# EAGLE design OpenSSM (EAGLE 5.09)
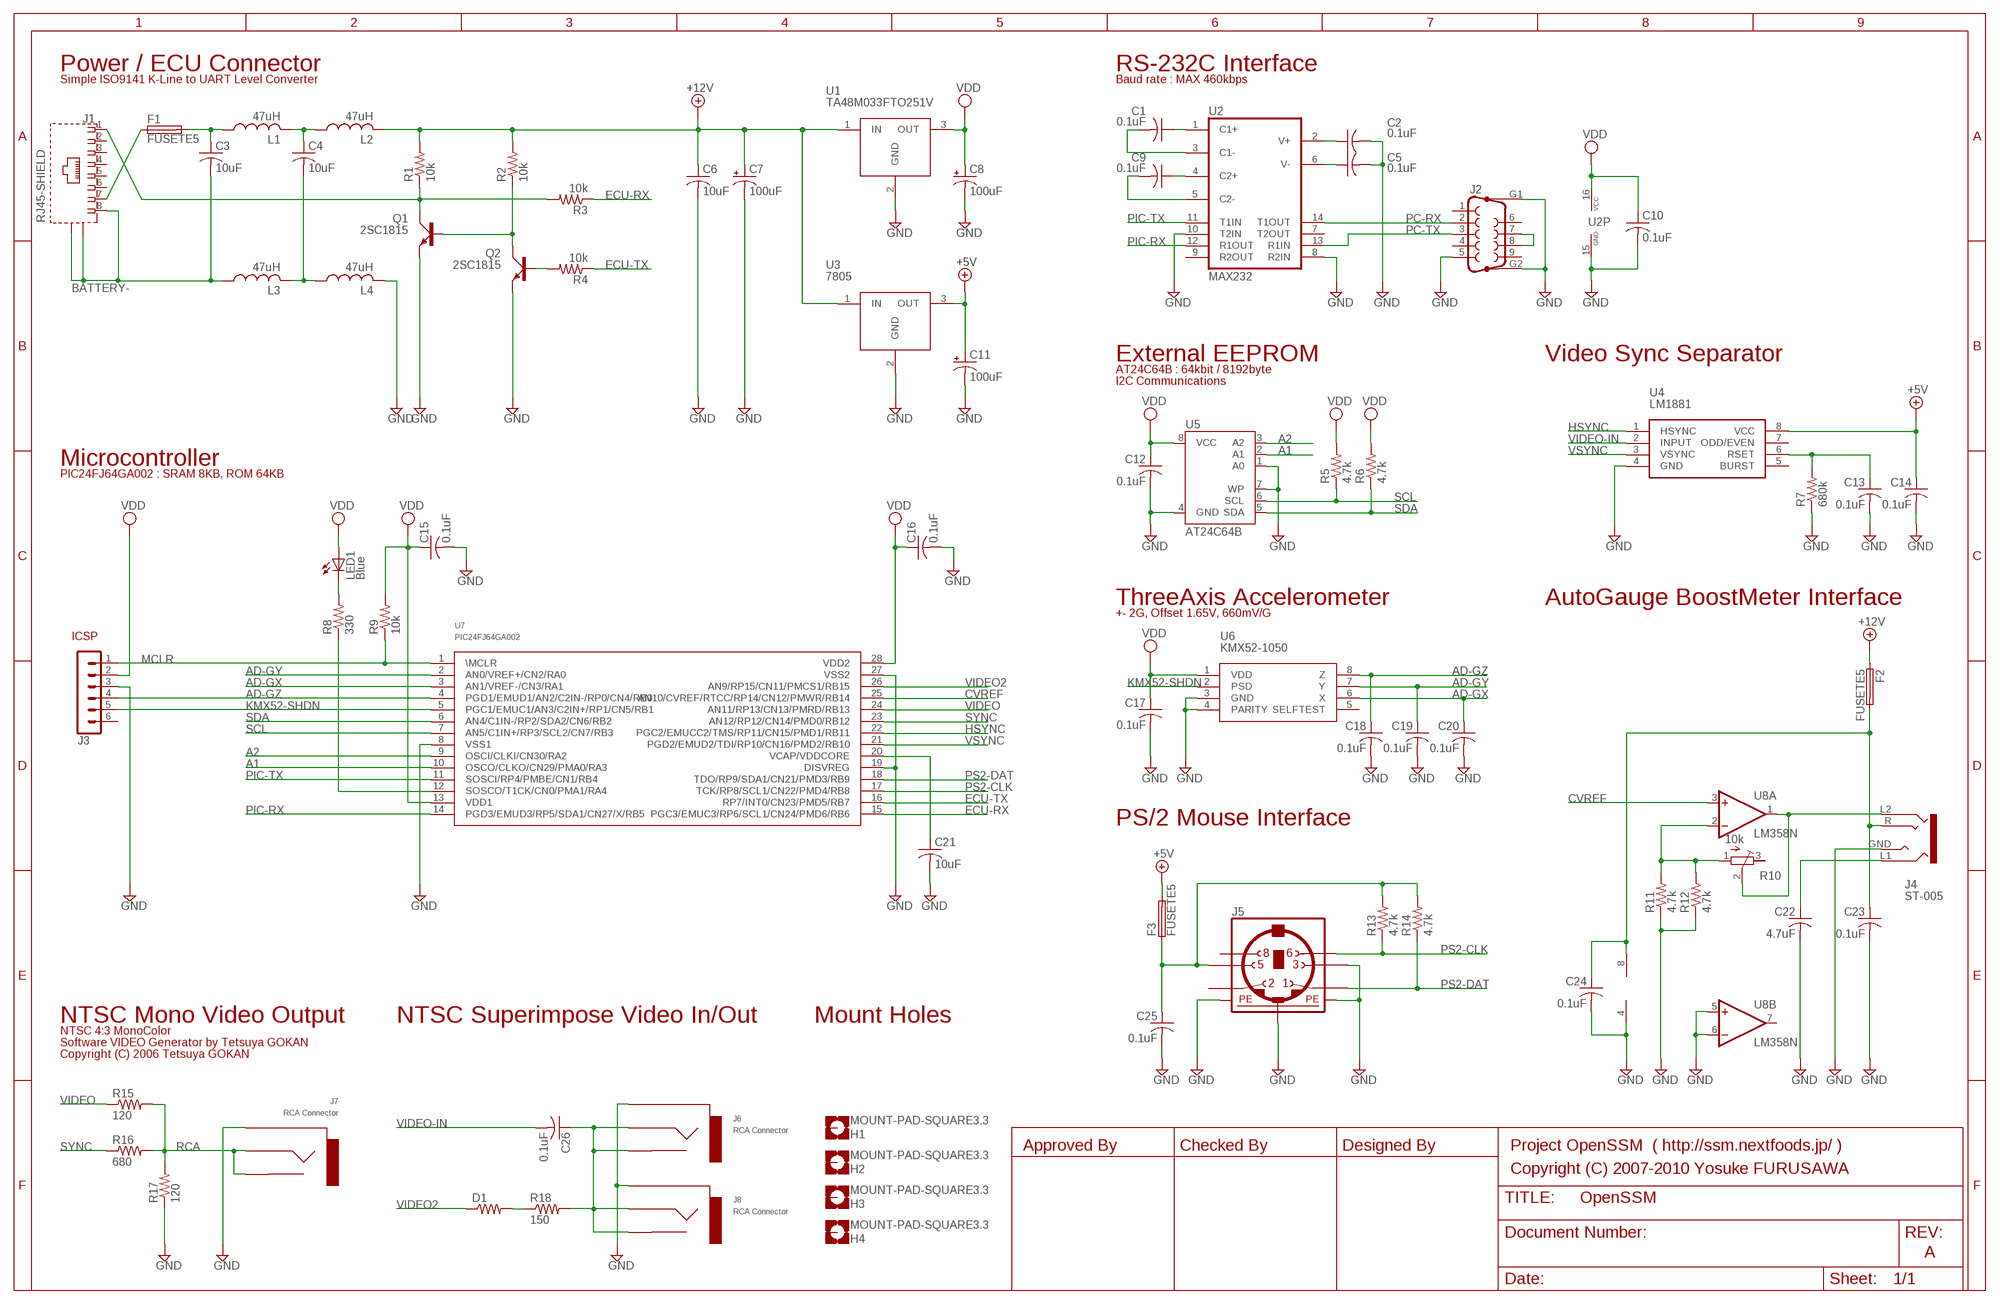
[diagram p0: schematic, sheet 1]

## Parts
C1  0.1uF  C-US025-024X044  [C025-024X044]
C2  0.1uF  C-US025-024X044  [C025-024X044]
C3  10uF  C-US050-025X075  [C050-025X075]
C4  10uF  C-US050-025X075  [C050-025X075]
C5  0.1uF  C-US025-024X044  [C025-024X044]
C6  10uF  C-US050-025X075  [C050-025X075]
C7  100uF  CPOL-USE2.5-7  [E2,5-7]
C8  100uF  CPOL-USE2.5-7  [E2,5-7]
C9  0.1uF  C-US025-024X044  [C025-024X044]
C10  0.1uF  C-US025-024X044  [C025-024X044]
C11  100uF  CPOL-USE2.5-7  [E2,5-7]
C12  0.1uF  C-US025-024X044  [C025-024X044]
C13  0.1uF  C-US025-024X044  [C025-024X044]
C14  0.1uF  C-US025-024X044  [C025-024X044]
C15  0.1uF  C-US025-024X044  [C025-024X044]
C16  0.1uF  C-US025-024X044  [C025-024X044]
C17  0.1uF  C-US025-024X044  [C025-024X044]
C18  0.1uF  C-US025-024X044  [C025-024X044]
C19  0.1uF  C-US025-024X044  [C025-024X044]
C20  0.1uF  C-US025-024X044  [C025-024X044]
C21  10uF  C-US050-025X075  [C050-025X075]
C22  4.7uF  C-US025-024X044  [C025-024X044]
C23  0.1uF  C-US025-024X044  [C025-024X044]
C24  0.1uF  C-US025-024X044  [C025-024X044]
C25  0.1uF  C-US025-024X044  [C025-024X044]
C26  0.1uF  C-US025-024X044  [C025-024X044]
D1  R-US_0204/2V  [0204V]
F1  FUSETE5  [TE5]
F2  FUSETE5  [TE5]
F3  FUSETE5  [TE5]
H1  MOUNT-PAD-SQUARE3.3  [3,3-PAD-SQUARE]
H2  MOUNT-PAD-SQUARE3.3  [3,3-PAD-SQUARE]
H3  MOUNT-PAD-SQUARE3.3  [3,3-PAD-SQUARE]
H4  MOUNT-PAD-SQUARE3.3  [3,3-PAD-SQUARE]
J1  RJ45-SHIELD  [RJ45]
J2  F09HP  [F09HP]
J3  MA06-1  [MA06-1]
J4  ST-005  STEREO_JACK2  [ST-005]
J5  MINI_DIN_6  [M_DIN6]
J6  RCA Connector  RCARCA  [RCA-BOARD]
J7  RCA Connector  RCARCA  [RCA-BOARD]
J8  RCA Connector  RCARCA  [RCA-BOARD]
L1  47uH  L-US0204V  [0204V]
L2  47uH  L-US0204V  [0204V]
L3  47uH  L-US0204V  [0204V]
L4  47uH  L-US0204V  [0204V]
LED1  Blue  LED5MM  [LED5MM]
Q1  2SC1815  [TO92-LINE]
Q2  2SC1815  [TO92-LINE]
R1  10k  R-US_0204/5  [0204/5]
R2  10k  R-US_0204/2V  [0204V]
R3  10k  R-US_0204/5  [0204/5]
R4  10k  R-US_0204/2V  [0204V]
R5  4.7k  R-US_0204/5  [0204/5]
R6  4.7k  R-US_0204/5  [0204/5]
R7  680k  R-US_0204/5  [0204/5]
R8  330  R-US_0204/5  [0204/5]
R9  10k  R-US_0204/2V  [0204V]
R10  10k  R-TRIMM3339P  [RTRIM3339P]
R11  4.7k  R-US_0204/5  [0204/5]
R12  4.7k  R-US_0204/5  [0204/5]
R13  4.7k  R-US_0204/5  [0204/5]
R14  4.7k  R-US_0204/5  [0204/5]
R15  120  R-US_0204/2V  [0204V]
R16  680  R-US_0204/2V  [0204V]
R17  120  R-US_0204/2V  [0204V]
R18  150  R-US_0204/2V  [0204V]
U1  TA48M033FTO251V  [TO251AA-V]
U2  MAX232  [DIL16]
U3  7805  TA48M033FTO251V  [TO251AA-V]
U4  LM1881  [DIL08]
U5  AT24C64B  AT24CP  [DIL08]
U6  KMX52-1050  [DIL08]
U7  PIC24FJ64GA002  PIC24FJ64GA004  [DIP28-3]
U8  LM358N  [DIL08]

## Nets
+5V: C11.+ C14.1 F3.2 U3.3(OUT) U4.8(VCC)
+12V: C6.1 C7.+ F2.1 L2.2 R1.2 R2.2 U1.1(IN) U3.1(IN)
A1: U5.2(A1) U7.10(OSCO/CLKO/CN29/PMA0/RA3)
A2: U5.3(A2) U7.9(OSCI/CLKI/CN30/RA2)
AD-GX: C20.1 U6.6(X) U7.3(AN1/VREF-/CN3/RA1)
AD-GY: C19.1 U6.7(Y) U7.2(AN0/VREF+/CN2/RA0)
AD-GZ: C18.1 J3.4 U6.8(Z) U7.4(PGD1/EMUD1/AN2/C2IN-/RP0/CN4/RB0)
BATTERY-: C3.2 J1.8 J1.A(S) J1.B(S) L3.1
CVREF: U7.25(AN10/CVREF/RTCC/RP14/CN12/PMWR/RB14) U8.3(A:+IN)
ECU-RX: R3.1 U7.15(PGC3/EMUC3/RP6/SCL1/CN24/PMD6/RB6)
ECU-TX: R4.1 U7.16(RP7/INT0/CN23/PMD5/RB7)
GND: C2.2 C5.2 C6.2 C7.- C8.- C10.2 C11.- C12.2 C13.2 C14.2 C15.2 C16.2 C17.2 C18.2 C19.2 C20.2 C21.2 C22.2 C23.2 C24.2 C25.2 J2.5 J2.G1 J2.G2 J3.3 J4.GND J5.3 J5.SH1(PE1) J5.SH2(PE2) J5.SH3(PE3) J6.P$1 J7.P$1 J8.P$1 L4.2 Q1.3(E) Q2.3(E) R7.1 R11.1 R12.1 R17.1 U1.2(GND) U2.8(R2IN) U2.10(T2IN) U2.15(GND) U3.2(GND) U4.4(GND) U5.1(A0) U5.4(GND) U5.7(WP) U6.3(GND) U6.4(PARITY) U7.8(VSS1) U7.19(DISVREG) U7.27(VSS2) U8.4(P:V-) U8.5(B:+IN) U8.6(B:-IN)
HSYNC: U4.1(HSYNC) U7.22(PGC2/EMUCC2/TMS/RP11/CN15/PMD1/RB11)
KMX52-SHDN: J3.5 U6.2(PSD) U7.5(PGC1/EMUC1/AN3/C2IN+/RP1/CN5/RB1)
MCLR: J3.1 R9.1 U7.1(\MCLR)
N$1: C21.1 U7.20(VCAP/VDDCORE)
N$2: C13.1 R7.2 U4.6(RSET)
N$3: LED1.K(C) R8.2
N$4: J1.1 Q1.2(C) R1.1 R3.2
N$5: C23.1 C24.1 F2.2 J4.R U8.8(P:V+)
N$6: F1.1 J1.7
N$7: Q1.1(B) Q2.2(C) R2.1
N$8: Q2.1(B) R4.2
N$9: C3.1 F1.2 L1.1
N$10: C4.1 L1.2 L2.1
N$11: C22.1 J4.L1
N$12: D1.2 R18.1
N$13: C1.1 U2.1(C1+)
N$14: C1.2 U2.3(C1-)
N$15: C9.1 U2.4(C2+)
N$16: C26.1 J6.P$2 J6.P$3 J8.P$2 J8.P$3 R18.2
N$17: C9.2 U2.5(C2-)
N$18: R8.1 U7.12(SOSCO/T1CK/CN0/PMA1/RA4)
N$19: C5.1 U2.6(V-)
N$20: C2.1 U2.2(V+)
N$21: J2.7 J2.8
N$22: C25.1 F3.1 J5.5 R13.2 R14.2
N$23: J4.L2 R10.2(S) U8.1(A:OUT)
N$25: C4.2 L3.2 L4.1
N$26: R10.1(E) R11.2 R12.2 U8.2(A:-IN)
PC-RX: J2.2 U2.14(T1OUT)
PC-TX: J2.3 U2.13(R1IN)
PIC-RX: U2.12(R1OUT) U7.14(PGD3/EMUD3/RP5/SDA1/CN27/X/RB5)
PIC-TX: U2.11(T1IN) U7.11(SOSCI/RP4/PMBE/CN1/RB4)
PS2-CLK: J5.6 R13.1 U7.17(TCK/RP8/SCL1/CN22/PMD4/RB8)
PS2-DAT: J5.1 R14.1 U7.18(TDO/RP9/SDA1/CN21/PMD3/RB9)
RCA: J7.P$2 J7.P$3 R15.2 R16.2 R17.2
SCL: R5.1 U5.6(SCL) U7.7(AN5/C1IN+/RP3/SCL2/CN7/RB3)
SDA: R6.1 U5.5(SDA) U7.6(AN4/C1IN-/RP2/SDA2/CN6/RB2)
SYNC: R16.1 U7.23(AN12/RP12/CN14/PMD0/RB12)
VDD: C8.+ C10.1 C12.1 C15.1 C16.1 C17.1 J3.2 LED1.A R5.2 R6.2 R9.2 U1.3(OUT) U2.16(VCC) U5.8(VCC) U6.1(VDD) U7.13(VDD1) U7.28(VDD2)
VIDEO: R15.1 U7.24(AN11/RP13/CN13/PMRD/RB13)
VIDEO2: D1.1 U7.26(AN9/RP15/CN11/PMCS1/RB15)
VIDEO-IN: C26.2 U4.2(INPUT)
VSYNC: U4.3(VSYNC) U7.21(PGD2/EMUD2/TDI/RP10/CN16/PMD2/RB10)
Unconnected: H1.B3,3(MOUNT) H2.B3,3(MOUNT) H3.B3,3(MOUNT) H4.B3,3(MOUNT) J1.2 J1.3 J1.4 J1.5 J1.6 J2.1 J2.4 J2.6 J2.9 J3.6 J5.2 J5.8 R10.3(A) U2.7(T2OUT) U2.9(R2OUT) U4.5(BURST) U4.7(ODD/EVEN) U6.5(SELFTEST) U8.7(B:OUT)

## Notes on the sheet
- Power / ECU Connector | RS-232C Interface
- Simple ISO9141 K-Line to UART Level Converter | Baud rate : MAX 460kbps
- External EEPROM | Video Sync Separator
- AT24C64B : 64kbit / 8192byte
- I2C Communications
- Microcontroller
- PIC24FJ64GA002 : SRAM 8KB, ROM 64KB
- ThreeAxis Accelerometer | AutoGauge BoostMeter Interface
- +- 2G, Offset 1.65V, 660mV/G
- ICSP
- PS/2 Mouse Interface
- NTSC Mono Video Output | NTSC Superimpose Video In/Out | Mount Holes
- NTSC 4:3 MonoColor
- Software VIDEO Generator by Tetsuya GOKAN
- Copyright (C) 2006 Tetsuya GOKAN
- Approved By | Checked By | Designed By | Project OpenSSM  ( http://ssm.nextfoods.jp/ )
- Copyright (C) 2007-2010 Yosuke FURUSAWA
- A

## Library data of the parts
C1-C6 C9 C10 C12-C26 = rcl:C-US: CAPACITOR, American symbol
C7 C8 C11 = rcl:CPOL-US: POLARIZED CAPACITOR, American symbol
D1 R1-R9 R11-R18 = rcl:R-US_: RESISTOR, American symbol
F1-F3 = fuse:FUSE: Fuse
H1-H4 = holes:MOUNT-PAD-SQUARE: MOUNTING PAD, square
J1 = akizuki:RJ45-SHIELD
J2 = con-subd:F09HP: SUB-D
J3 = con-lstb:MA06-1: PIN HEADER
J4 = akizuki:STEREO_JACK2
J5 = mini_din:MINI_DIN_6
J6-J8 = akizuki:RCA
L1-L4 = rcl:L-US: INDUCTOR, American symbol
LED1 = led:LED: LED OSRAM: - CHIPLED LG R971, LG N971, LY N971, LG Q971, LY Q971, LO R971, LY R971 LH N974, LH R974 LS Q976, LO Q976, LY Q976 LO Q996 - Hyper CHIPLED LW Q18S LB Q993, LB Q99A, LB R99A - SideLED LS A670, LO A670, LY A670, LG A670, LP A670 LB A673, LV A673, LT A673, LW A673 LH A674 LY A675 LS A676, LA A676, LO A676, LY A676, LW A676 LS A679, LY A679, LG A679 - Hyper Micro SIDELED® LS Y876, LA Y876, LO Y876, LY Y876 LT Y87S - SmartLED LW L88C, LW L88S LB L89C, LB L89S, LG L890 LS L89K, LO L89K, LY L89K LS L896, LA L896, LO L896, LY L896 - TOPLED LS T670, LO T670, LY T670, LG T670, LP T670 LSG T670, LSP T670, LSY T670, LOP T670, LYG T670 LG T671, LOG T671, LSG T671 LB T673, LV T673, LT T673, LW T673 LH T674 LS T676, LA T676, LO T676, LY T676, LB T676, LH T676, LSB T676, LW T676 LB T67C, LV T67C, LT T67C, LS T67K, LO T67K, LY T67K, LW E67C LS E67B, LA E67B, LO E67B, LY E67B, LB E67C, LV E67C, LT E67C LW T67C LS T679, LY T679, LG T679 LS T770, LO T770, LY T770, LG T770, LP T770 LB T773, LV T773, LT T773, LW T773 LH T774 LS E675, LA E675, LY E675, LS T675 LS T776, LA T776, LO T776, LY T776, LB T776 LHGB T686 LT T68C, LB T68C - Hyper Mini TOPLED® LB M676 - Mini TOPLED Santana® LG M470 LS M47K, LO M47K, LY M47K Source: http://www.osram.convergy.de - LUMILED® LXK2-PW12-R00, LXK2-PW12-S00, LXK2-PW14-U00, LXK2-PW14-V00 LXK2-PM12-R00, LXK2-PM12-S00, LXK2-PM14-U00 LXK2-PE12-Q00, LXK2-PE12-R00, LXK2-PE12-S00, LXK2-PE14-T00, LXK2-PE14-U00 LXK2-PB12-K00, LXK2-PB12-L00, LXK2-PB12-M00, LXK2-PB14-N00, LXK2-PB14-P00, LXK2-PB14-Q00 LXK2-PR12-L00, LXK2-PR12-M00, LXK2-PR14-Q00, LXK2-PR14-R00 LXK2-PD12-Q00, LXK2-PD12-R00, LXK2-PD12-S00 LXK2-PH12-R00, LXK2-PH12-S00 LXK2-PL12-P00, LXK2-PL12-Q00, LXK2-PL12-R00 Source: www.luxeon.com
Q1 Q2 = akihabara:2SC1815: 2SC1815 Audio frequency general purpose amplifier. Package ECB. Complementary to 2SA1015
R10 = resistor:R-TRIMM: Trimm resistor
U1 U3 = akizuki:TA48M033F
U2 = maxim:MAX232: RS232 TRANSEIVER
U4 = akizuki:LM1881
U5 = atmel:AT24C*: 2-wire serial EEPROM
U6 = akizuki:KMX52-1050
U7 = akizuki:PIC24FJ64GA004
U8 = linear:LM358: OP AMP also LM158; LM258; LM2904 Source: http://cache.national.com/ds/LM/LM158.pdf

## Board
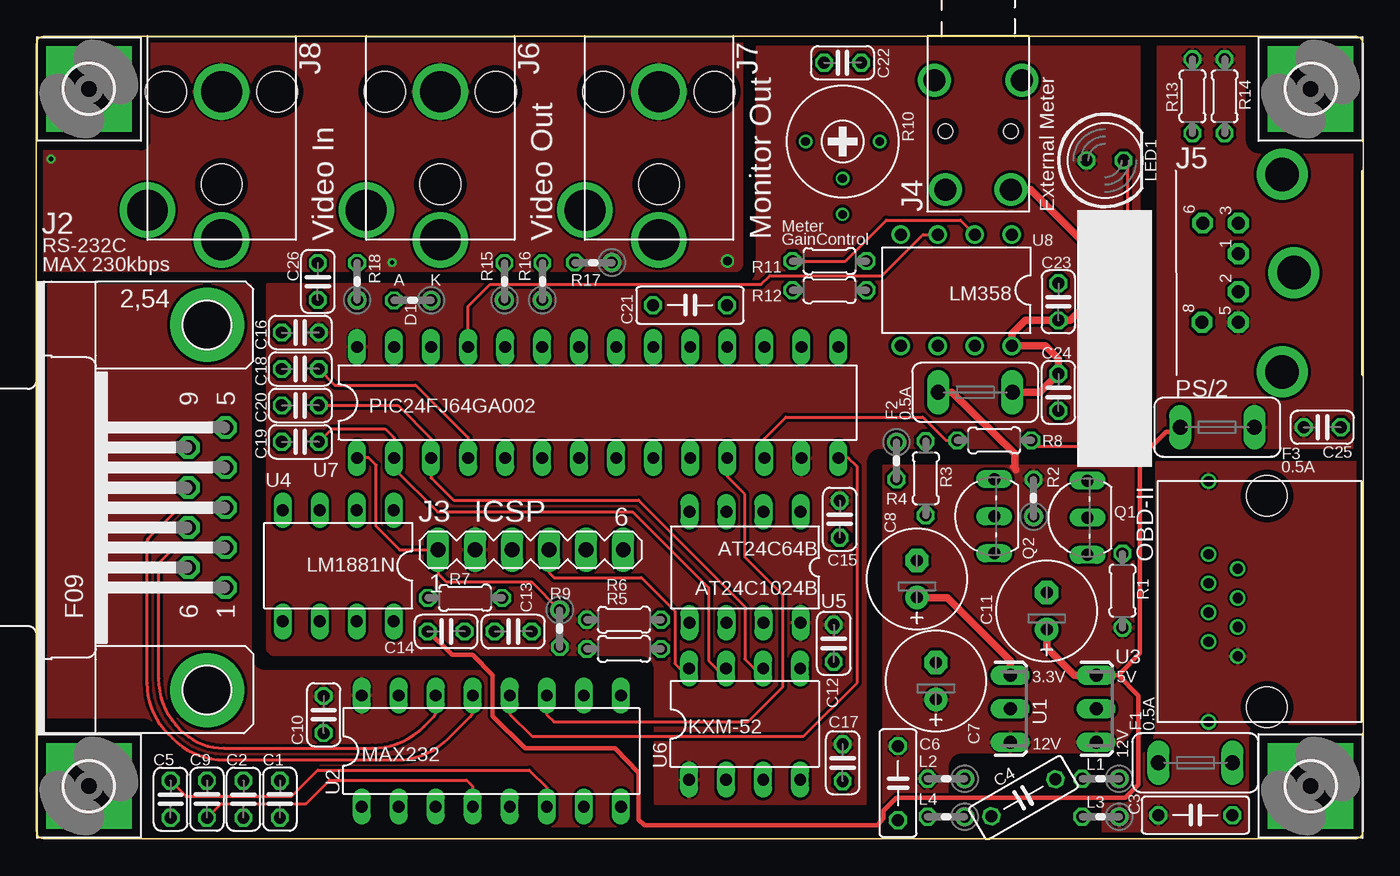
[diagram p1: board, top side]
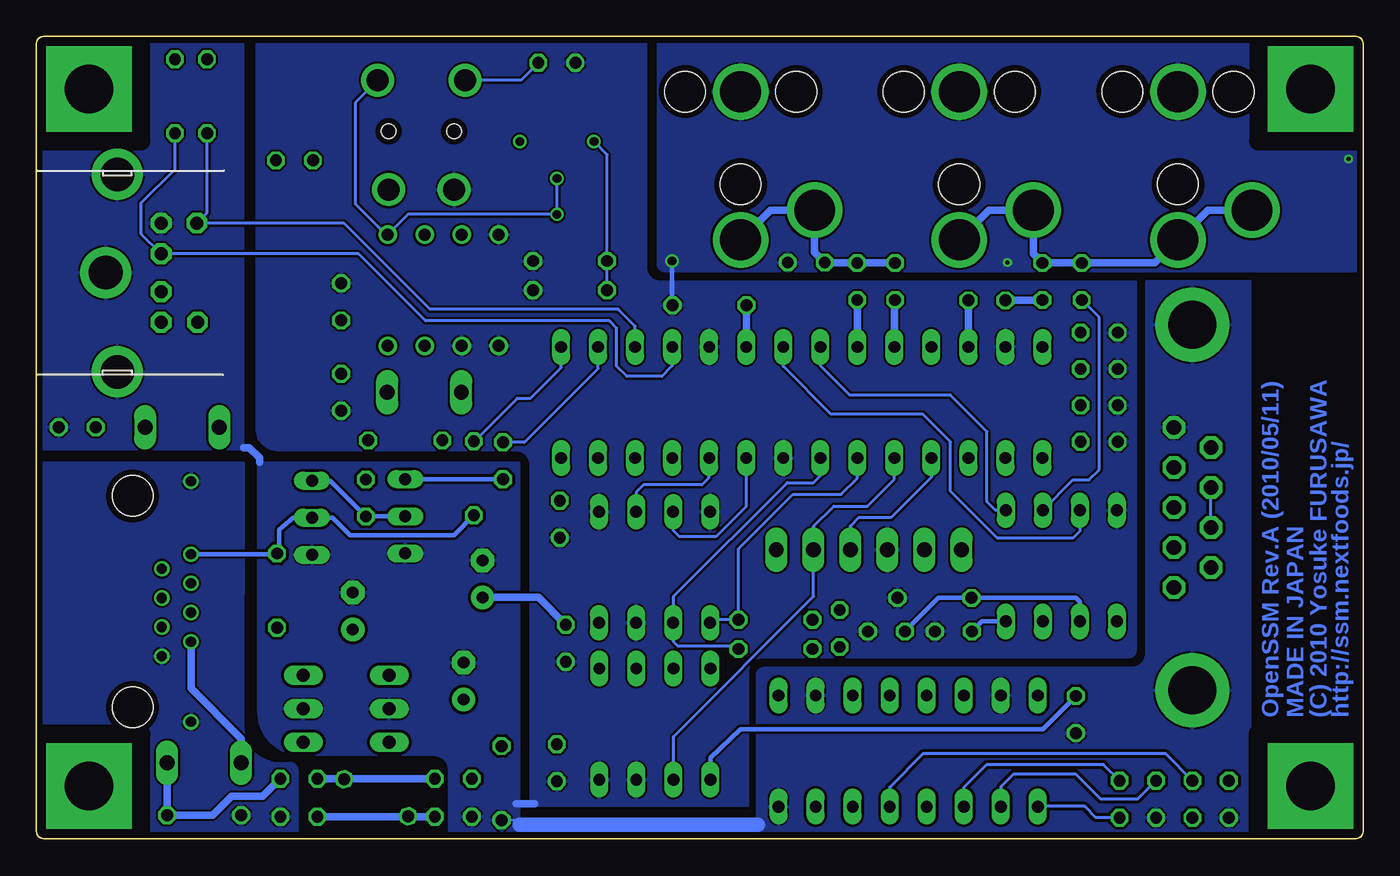
[diagram p2: board, bottom side, seen from below]

Size 91 x 55 mm. Coordinates in mm from the lower left corner, seen from the top.
Outline: 0.5,55 arc90 0,54.5 0,0.5 arc90 0.5,0 90.5,0 arc90 91,0.5 91,54.5 arc90 90.5,55 0.5,55
Copper layers (1*16): Top 0.035mm / dielectric 1.5mm / Bottom 0.035mm
Design rules "p-ban_min-0.130mm": minimum track width 0.13mm, minimum drill 0.3mm, track to track 0.13mm, track to pad 0.13mm, pad to pad 0.13mm, via to via 0.13mm, smd to smd 5mil, copper to edge 0.4mm, drill to drill 0.45mm, minimum pad ring 0.15mm, minimum via ring 0.15mm, stop-mask expansion 4mil, vias tented up to drill 0mil, thermal gap 0.13mm

### Footprints (pad centres in the part's own frame; a part is rotated, then mirrored left to right if it is on the bottom)
C025-024X044 = drill 0.813 octagon: 1 -1.27,0; 2 1.27,0
C050-025X075 = drill 0.813 octagon: 1 -2.54,0; 2 2.54,0
E2,5-7 = drill 0.813 pad 1.6 round: + -1.27,0 | drill 0.813 pad 1.6 octagon: - 1.27,0
0204V = drill 0.813 octagon: 1 -1.27,0; 2 1.27,0
TE5 = drill 1.016 long: 1 -2.54,0; 2 2.54,0
3,3-PAD-SQUARE = drill 3.3 pad 5.842 square: B3,3 0,0
RJ45 = drill 0.7 round: 1 -3.5,3.3; 2 -1.5,2.3; 3 -3.5,1.3; 4 -1.5,0.3; 5 -3.5,-0.7; 6 -1.5,-1.7; 7 -3.5,-2.7; 8 -1.5,-3.7; A -3.5,-8.2; B -3.5,8.3 | hole 2.8: 0.5,-7.2; 0.5,7.3
F09HP = drill 1.016 octagon: 1 -5.486,-1.27; 2 -2.743,-1.27; 3 0,-1.27; 4 2.743,-1.27; 5 5.486,-1.27; 6 -4.115,1.27; 7 -1.372,1.27; 8 1.372,1.27; 9 4.115,1.27 | drill 3.302 pad 5.08 round: G1 -12.522,0; G2 12.522,0
MA06-1 = drill 1.016 long: 1 -6.35,0; 2 -3.81,0; 3 -1.27,0; 4 1.27,0; 5 3.81,0; 6 6.35,0
ST-005 = drill 1.5 round: GND -7,2.25; L1 0.5,3; L2 0.5,-3; R -7,-2.25 | hole 1: -3,2.25; -3,-2.25
M_DIN6 = drill 0.9 pad 1.422 octagon: 1 -1.3,-3.75; 2 1.3,-3.75; 3 -3.4,-3.75; 5 3.4,-3.75; 6 -3.4,-6.2; 8 3.4,-6.25 | drill 2.3 pad 3.5 round: SH1 6.8,-0.75; SH2 0,0.05; SH3 -6.75,-0.75
RCA-BOARD = drill 2.8 round: P$1 0,-3.81; P$2 0,6.35; P$3 5.08,4.31 | hole 2.8: 0,2.54; 3.81,-3.81; -3.81,-3.81
LED5MM = drill 0.813 octagon: A -1.27,0; K 1.27,0
TO92-LINE = drill 0.813 long: 1 2.54,0; 2 0,0; 3 -2.54,0
0204/5 = drill 0.813 octagon: 1 -2.54,0; 2 2.54,0
RTRIM3339P = drill 0.61 round: 1 -2.54,0; 2 0,-2.54; 3 2.54,0
TO251AA-V = drill 0.889 long: 1 -2.286,0; 2 0,0; 3 2.286,0
DIL16 = drill 0.813 long: 1 -8.89,-3.81; 2 -6.35,-3.81; 3 -3.81,-3.81; 4 -1.27,-3.81; 5 1.27,-3.81; 6 3.81,-3.81; 7 6.35,-3.81; 8 8.89,-3.81; 9 8.89,3.81; 10 6.35,3.81; 11 3.81,3.81; 12 1.27,3.81; 13 -1.27,3.81; 14 -3.81,3.81; 15 -6.35,3.81; 16 -8.89,3.81
DIL08 = drill 0.813 long: 1 -3.81,-3.81; 2 -1.27,-3.81; 3 1.27,-3.81; 4 3.81,-3.81; 5 3.81,3.81; 6 1.27,3.81; 7 -1.27,3.81; 8 -3.81,3.81
DIP28-3 = drill 0.813 long: 1 -16.51,-3.81; 2 -13.97,-3.81; 3 -11.43,-3.81; 4 -8.89,-3.81; 5 -6.35,-3.81; 6 -3.81,-3.81; 7 -1.27,-3.81; 8 1.27,-3.81; 9 3.81,-3.81; 10 6.35,-3.81; 11 8.89,-3.81; 12 11.43,-3.81; 13 13.97,-3.81; 14 16.51,-3.81; 15 16.51,3.81; 16 13.97,3.81; 17 11.43,3.81; 18 8.89,3.81; 19 6.35,3.81; 20 3.81,3.81; 21 1.27,3.81; 22 -1.27,3.81; 23 -3.81,3.81; 24 -6.35,3.81; 25 -8.89,3.81; 26 -11.43,3.81; 27 -13.97,3.81; 28 -16.51,3.81
DIL08' = drill 0.813 pad 1.27 round: 1 -3.81,-3.81; 2 -1.27,-3.81; 3 1.27,-3.81; 4 3.81,-3.81; 5 3.81,3.81; 6 1.27,3.81; 7 -1.27,3.81; 8 -3.81,3.81

### Placement (x,y rotation side)
C1  16.7,2.7 90 top
C2  14.2,2.7 270 top
C3  79.5,1.6 180 top
C4  67.7,2.8 210 top
C5  9.2,2.7 270 top
C6  59.1,3.8 270 top
C7  61.7,10.8 90 top
C8  60.4,17.8 90 top
C9  11.7,2.7 90 top
C10  19.7,8.5 270 top
C11  69.3,15.6 90 top
C12  54.69,13.39 270 top
C13  32.7,14.2 0 top
C14  28.1,14.2 0 top
C15  55.1,21.9 270 top
C16  18.1,34.7 180 top
C17  55.3,5.2 270 top
C18  18.1,32.2 180 top
C19  18.1,27.2 180 top
C20  18.1,29.7 180 top
C21  44.83,36.57 0 top
C22  55.3,53.2 180 top
C23  70.1,36.8 90 top
C24  70.1,30.6 270 top
C25  88.2,28.2 0 top
C26  19.3,38.2 270 top
D1  25.8,36.9 180 top
F1  79.5,5.2 0 top
F2  64.4,30.6 0 top
F3  81,28.2 180 top
H1  3.6,51.4 0 top
H2  3.6,3.6 0 top
H3  87.4,51.4 0 top
H4  87.4,3.6 0 top
J1  83.9,16.2 0 top
J2  11.7,22.7 90 top
J3  33.9,19.8 0 top
J4  64.6,51.5 90 top
J5  86.2,38.8 270 top
J6  27.7,47.4 180 top
J7  42.7,47.4 180 top
J8  12.7,47.4 180 top
L1  73,4.1 180 top
L2  62.4,4.1 180 top
L3  73,1.5 180 top
L4  62.4,1.5 180 top
LED1  73.3,46.5 0 top
Q1  72.1,22 90 top
Q2  65.7,22.1 90 top
R1  74.5,17 270 top
R2  68.4,23.35 90 top
R3  61,24.7 270 top
R4  59,25.9 270 top
R5  40.3,13 180 top
R6  40.3,15 180 top
R7  29.4,16.5 180 top
R8  65.7,27.3 0 top
R9  35.9,14.4 270 top
R10  55.3,47.8 0 top
R11  54.4,39.6 180 top
R12  54.4,37.6 180 top
R13  79.3,50.9 90 top
R14  81.5,50.9 90 top
R15  32.1,38.2 90 top
R16  34.7,38.2 90 top
R17  38.2,39.5 180 top
R18  22,38.2 90 top
U1  66.8,8.9 90 top
U2  31.2,6 0 top
U3  72.7,8.9 90 top
U4  20.7,18.7 180 top
U5  48.6,18.6 180 top
U6  48.58,7.85 0 top
U7  38.5,29.9 0 top
U8  LM358N  [DIL08']  63.1,37.6 180 top

### Tracks (layer width: path | path; a pad name or v marks a point on that pad's centre or on a via)
+5V
  Top 0.3: F3.2 78.3,28.2 78.3,27.9 77.5,27.9 75.7,26.1 75.7,12.7 74.2,11.2 | C14.1 26.8,14.3 28.5,12.6 29.9,12.6 31.3,11.2 31.3,8.4 33.5,6.2 39.7,6.2 41.3,4.5 41.3,1.3 41.7,0.9 57.7,0.9 58.1,1.4 58.1,1.9 59,2.8 74.7,2.8 75.6,3.7 75.6,9.8 74.2,11.2 | C11.+ 69.53,14.3 | 74.2,11.2 72.71,11.2 U3.3
  Top 0.5: C11.+ 69.3,13.1 71.2,11.2 72.69,11.2 U3.3
  Bottom 0.3: U4.8 26.14,14.89 C14.1
+12V
  Top 0.3: 67.17,25.3 66.9,25.5
  Top 0.5: F2.1 62.8,30.6 67.1,26.4 67.1,25.47 67.17,25.3
  pour Top (isolate 0.2): 58.1,0.8 58.1,25.6 75.5,25.6 75.5,8.9 arc-90 72.5,5.9 63.5,5.9 arc90 62.5,4.9 62.5,0.8
A1
  Bottom 0.2: U5.2 49.87,23.73 49.35,24.25 45.35,24.25 44.85,24.75 U7.10
A2
  Bottom 0.2: U5.3 47.33,21.13 46.9,20.7 44.4,20.7 42.3,22.8 U7.9
  Bottom 0.3: U7.9
AD-GX
  Top 0.2: U6.6 49.24,11.66 48.6,12.3 48.6,15.9 41.3,23.2 28.6,23.2 27.07,24.73 U7.3 27.07,27.43 24.8,29.7 C20.1
AD-GY
  Top 0.2: U6.7 46.64,11.66 46.1,12.2 46.1,17.2 40.9,22.4 27.5,22.4 24.53,25.37 U7.2 24.53,27.47 23.9,28.1 20.27,28.1 C19.1
AD-GZ
  Top 0.2: U6.8 44.14,11.66 43.8,12 43.8,15.6 41.5,17.9 35.5,17.9 35.17,18.23 J3.4 | C18.1 20.47,31.1 26,31.1 29.61,27.49 U7.4
  Bottom 0.2: U7.4 29.61,24.79 32.4,22 34.6,22 35.17,21.43 J3.4
BATTERY-
  pour Bottom (isolate 0.15): 91,0 91,25.8 76.8,25.8 76.81,7.68 arc-90 74.31,5.2 73.6,5.2 arc90 73.1,4.7 73.1,0
  pour Top (isolate 0.15): 91,0 91,25.8 76.8,25.8 76.8,7.7 arc-90 74.3,5.2 73.6,5.2 arc90 73.1,4.7 73.1,0
CVREF
  Top 0.2: U7.25 29.61,36.51 31.1,38 49.7,38 50.3,38.6 58,38.6 60.81,41.41 U8.3
ECU-RX
  Bottom 0.2: U7.15 55.01,32.29 57.1,30.2 58,30.2 60.96,27.24 R3.1
ECU-TX
  Bottom 0.2: U7.16 52.47,32.23 57.53,27.17 R4.1
GND  (via drill 0.3, 0.6)
  Bottom 0.15: 57.85,0.95 58.16,1.26 C6.2
  Bottom 0.3: C21.2 47.4,36.47 v47.4,39.6
  Bottom 0.5: 55.5,0.95 arc-90 55.3,1.15 | 76.8,26.8 76.4,26.8 75.7,26.1 75.7,25.8 | 56.83,2.4 58.1,2.4
  Bottom 1: 41.5,0.95 55.5,0.95 57.85,0.95
  other vias: 24.4,39.5 1,46.6
  pour Bottom (isolate 0.2): 57.9,0 62.7,0 62.7,4.7 arc-90 63.7,5.7 72.78,5.7 arc91 75.78,8.74 75.8,25.8 57.9,25.8
  pour Bottom (isolate 0.15): 91,55 91,26.7 76.8,26.7 76.8,55
  pour Bottom (isolate 0.2): 7.7,0 7.7,38.2 14.9,38.2 14.9,12.7 arc90 15.9,11.7 41.1,11.7 arc-90 41.6,11.2 41.6,0
  pour Bottom (isolate 0.15): 0,55 48.4,55 48.4,39.4 arc-90 47.9,38.9 0,38.9
  pour Top (isolate 0.15): 0,55 48.4,55 48.4,39.4 arc-90 47.9,38.9 0,38.9
  pour Bottom (isolate 0.15): 15.6,38.2 15.6,12.9 arc90 16.1,12.4 41.2,12.4 arc-90 42.2,11.4 42.2,2.2 57.1,2.2 57.1,25.6 arc-90 58.1,26.6 74.4,26.6 arc90 75.9,28.1 75.9,55 49.2,55 49.2,39.2 arc-90 48.2,38.2
HSYNC
  Bottom 0.2: U7.22 37.23,32.43 35.2,30.4 28.3,30.4 25.8,27.9 25.8,23.1 25.21,22.51 U4.1
KMX52-SHDN
  Bottom 0.2: U7.5 32.15,24.65 34,22.8 36.3,22.8 37.7,21.4 J3.5 37.7,16.6 47.31,6.99 U6.2
MCLR
  Top 0.2: 21.95,26.13 U7.1 22.8,26.1 23.3,25.6 23.3,21.4 24.9,19.8 J3.1 27.55,18.15 28.1,17.6 33.97,17.6 R9.1
N$1
  Bottom 0.5: C21.1 42.31,36.47 U7.20
N$2
  Bottom 0.3: U4.6 19.43,16.23 19.7,16.5 R7.2 29.13,16.5 C13.1
N$3
  Top 0.2: LED1.K 74.87,45.9 74.87,30.07 71.7,26.9 68.64,26.9 R8.2
N$4
  Bottom 0.2: 74.34,19.5 R1.1
  Bottom 0.3: J1.1 74.34,19.5 74.34,21.16 73.4,22 Q1.2 70.7,22 69.5,20.8 62.36,20.8 R3.2
N$5
  Top 0.406: U8.8
  Top 0.5: F2.2 68.83,30.6 C24.1 70.1,32.9 69.21,33.79 U8.8 | U8.8 66.9,34.6 67.83,35.53 C23.1 70.93,35.53 71.8,36.4 71.8,40.9 68.2,44.5 J4.R
N$6
  Bottom 0.5: F1.1 76.96,6.86 80.4,10.3 J1.7
N$7
  Bottom 0.3: Q2.2 67.78,22.1 R2.1 70.86,24.54 Q1.1
N$8
  Bottom 0.2: R4.2 59.61,24.64
  Bottom 0.3: 59.61,24.64 Q2.1
N$9
  Bottom 0.5: F1.2 C3.1 78.9,1.6 77.6,2.9 75.47,2.9 L1.1
N$10
  Bottom 0.5: L1.2 69.89,4.1 arc-45 C4.1 69.87,4.1 L2.1
N$11
  Bottom 0.2: C22.1 57.77,52 J4.L1
N$12
  Bottom 0.5: D1.2 22.03,36.9 R18.1
N$13
  Bottom 0.2: C1.1 18.33,1.43 19.1,2.2 U2.1
N$14
  Bottom 0.2: U2.3 27.4,3.5 25.83,5.07 17.8,5.07 C1.2
  Bottom 0.3: U2.3
N$15
  Top 0.2: C9.1 12.67,2.4 18.5,2.4 20.1,4 29.5,4 29.93,3.57 U2.4
N$16
  Bottom 0.5: J8.P$3 10.66,43.09 J8.P$2 14.28,39.47 C26.1 R18.2 22.62,40.09 J6.P$3 25.66,43.09 J6.P$2
N$17
  Bottom 0.2: C9.2 13.53,5.8 30.2,5.8 32.47,3.53 U2.5
N$18
  Top 0.2: U7.12 49.93,27.43 51.4,28.9 60.8,28.9 62.4,27.3 R8.1
N$19
  Top 0.2: C5.1 10.27,2.9 17.5,2.9 19.3,4.7 33.8,4.7 35.01,3.49 U2.6
N$20
  Bottom 0.2: U2.2 24.85,3.55 24,4.4 19.7,4.4 18,2.7 15.47,2.7 C2.1
N$21
  Bottom 0.2: J2.7 J2.8
N$22
  pour Top (isolate 0.2): 90.3,26.8 90.3,46.9 83.9,46.9 arc-90 82.9,47.9 82.9,54.3 76.9,54.3 76.9,26.8
N$23  (via drill 0.6)
  Bottom 0.2: R10.2 v55.3,42.8 65.52,42.8 U8.1 67.01,41.41 69.1,43.5 69.1,50.5 J4.L2
N$25
  Bottom 0.5: L4.1 65.5,1.5 arc-45 C4.2 arc-45 65.54,1.5 L3.2
N$26
  Top 0.2: U8.2 63.38,42.4 58.3,42.4 55.5,39.6 R11.2
  Bottom 0.2: R10.1 51.86,46.9 R11.2 R12.2
PC-RX
  Top 0.2: U2.14 27.39,8.7 arc-45 27.24,8.34 26.56,7.67 arc-45 23.03,6.2 12.85,6.2 arc-45 9.86,7.44 arc-45 8.4,10.97 8.4,18.69 arc-45 8.55,19.05 9.35,19.85 arc-45 9.71,20 12.87,20 arc-45 J2.2
PC-TX
  Top 0.2: U2.13 29.93,8.74 arc-45 29.78,8.38 28.27,6.86 arc-45 24.73,5.4 12.87,5.4 arc-45 9.34,6.86 9.06,7.14 arc-45 7.6,10.67 7.6,20.29 arc-45 7.75,20.65 9.65,22.55 arc-45 10.01,22.7 J2.3
PIC-RX
  Top 0.2: U2.12 32.47,8.53 34,7 52.6,7 56.3,10.7 56.3,25.5 55.71,26.09 U7.14
PIC-TX
  Top 0.2: U7.11 47.39,24.81 48.6,23.6 48.6,19.3 51.2,16.7 51.2,10.4 48.8,8 35.5,8 35,8.5 U2.11
PS2-CLK
  Bottom 0.2: R13.1 79.3,42.9 J5.6 69.9,42.2 64,36.3 51.1,36.3 49.93,35.13 U7.17
PS2-DAT
  Bottom 0.2: R14.1 81.5,45.9 83.8,43.6 83.8,41.45 J5.1 68.9,40.1 64.3,35.5 51.7,35.5 51.2,35 51.2,32.4 50.5,31.7 48.1,31.7 47.39,32.41 U7.18
RCA
  Bottom 0.5: J7.P$2 40.66,43.09 J7.P$3 37.62,40.19 R17.2 34.73,39.5 R16.2 R15.2
SCL
  Bottom 0.2: U7.7 37.23,24.87 37.7,24.4 39.5,24.4 47.3,16.6 47.3,14.82 47.3,13.5 47,13.2 43.44,13.2 R5.1
  Bottom 0.3: 47.3,14.82 U5.6
SDA
  Bottom 0.2: U7.6 34.69,24.71 35.8,23.6 39.1,23.6 42.84,19.86 R6.1 44.48,15 U5.5
SYNC
  Bottom 0.5: U7.23 R16.1
VDD
  Top 0.5: U1.3 66.8,12.2 62.5,16.5 60.43,16.5 C8.+
  Bottom 0.3: U6.1 44.77,5.53 42.7,7.5 21.97,7.5 C10.1
  Bottom 0.5: 60.43,16.5 C8.+ 56.56,16.53 C12.1
  pour Top (isolate 0.2): 0.8,8.3 0.8,38 14.7,38 14.7,12.5 arc90 15.7,11.5 40.9,11.5 arc-90 41.4,11 41.4,0.8 8.3,0.8 8.3,7.3 arc90 7.3,8.3
  pour Top (isolate 0.2): 42.4,2.4 56.9,2.4 56.9,25.8 arc-90 57.9,26.8 74.2,26.8 arc90 75.7,28.3 75.7,54.3 49.4,54.3 49.4,39 arc-90 48.4,38 15.8,38 15.8,13.1 arc90 16.3,12.6 41.4,12.6 arc-90 42.4,11.6
VIDEO
  Bottom 0.5: U7.24 32.15,36.88 R15.1
VIDEO2
  Bottom 0.5: U7.26 D1.1
VIDEO-IN
  Bottom 0.2: U4.2 19.9,24.6 18.8,24.6 18.1,25.3 18.1,35.73 C26.2
VSYNC
  Bottom 0.2: U4.3 19.43,21.07 19.9,20.6 25.1,20.6 28.3,23.8 28.3,27.2 30.2,29.1 36.5,29.1 39.77,32.37 U7.21

### Text on the board
Bottom: http://ssm.nextfoods.jp/ | (C) 2010 Yosuke FURUSAWA | MADE IN JAPAN | OpenSSM Rev.A (2010/05/11)
tPlace: External Meter | Meter | Video In | Video Out | Monitor Out | GainControl | RS-232C | MAX 230kbps | A | K | LM358 | PS/2 | PIC24FJ64GA002 | 0.5A | 0.5A | ICSP | AT24C64B | LM1881N | OBD-II | AT24C1024B | 3.3V | 5V | 12V | KXM-52 | 0.5A | 12V | MAX232